# EAGLE design Adafruit 1.54in 240x240 TFT EYESPI (EAGLE 9.6.2)
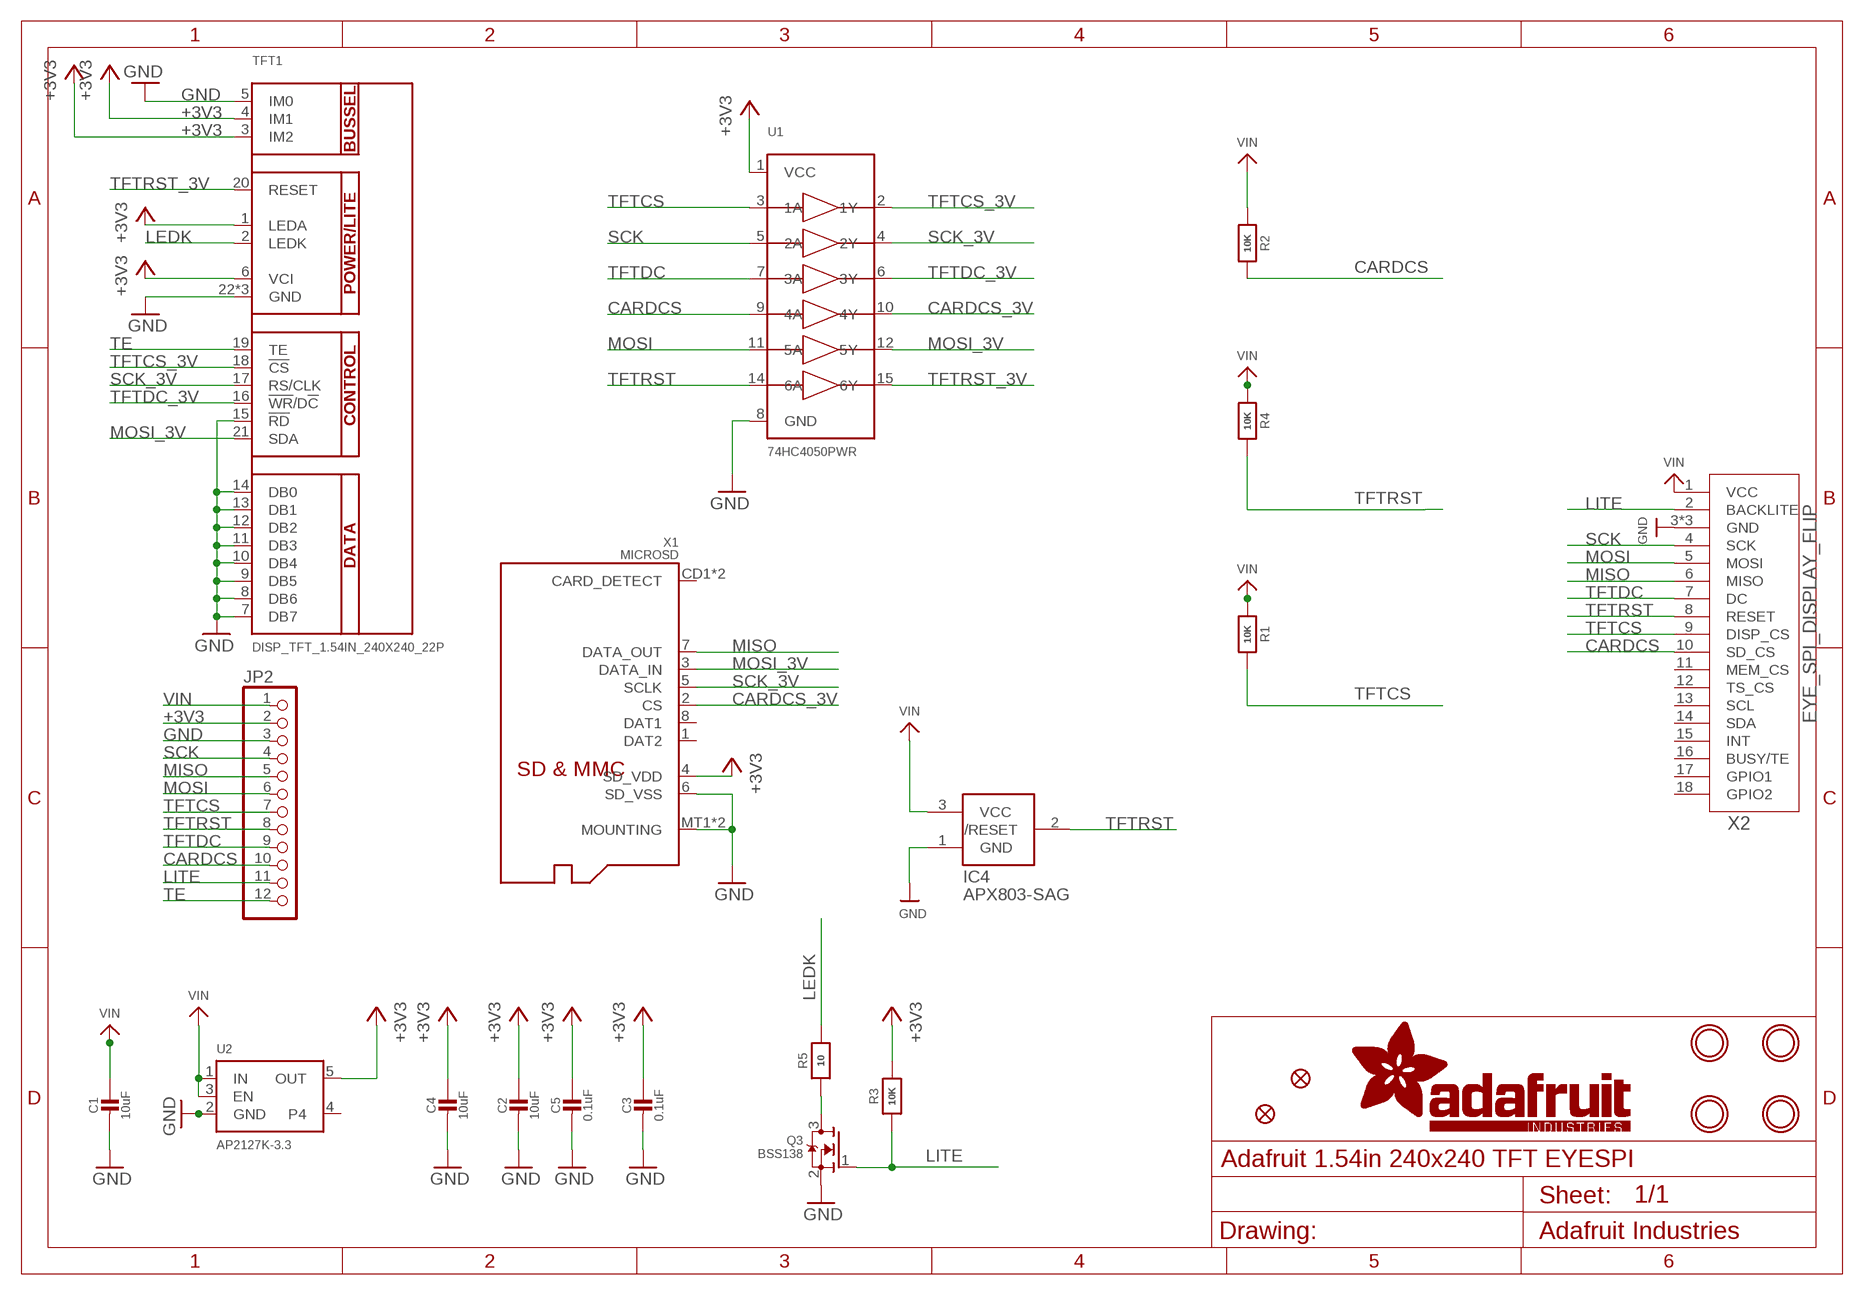
[diagram p0: schematic, sheet 1]

## Parts
C1  10uF  CAP_CERAMIC0805-NOOUTLINE  [0805-NO]
C2  10uF  CAP_CERAMIC0805-NOOUTLINE  [0805-NO]
C3  0.1uF  CAP_CERAMIC0603_NO  [0603-NO]
C4  10uF  CAP_CERAMIC0805-NOOUTLINE  [0805-NO]
C5  0.1uF  CAP_CERAMIC0603_NO  [0603-NO]
IC4  APX803-SAG  APX083-SAG  [SOT23-WIDE]
JP2  HEADER-1X1276MIL  [1X12_ROUND_76MIL]
Q3  BSS138  MOSFET-NWIDE  [SOT23-WIDE]
R1  10K  RESISTOR_0603_NOOUT  [0603-NO]
R2  10K  RESISTOR_0603_NOOUT  [0603-NO]
R3  10K  RESISTOR_0603_NOOUT  [0603-NO]
R4  10K  RESISTOR_0603_NOOUT  [0603-NO]
R5  10  RESISTOR_0603_NOOUT  [0603-NO]
TFT1  DISP_TFT_1.54IN_240X240_22P  [TFT_1.54IN_240X240_22PIN]
U1  74HC4050PWR  74HC4050DTSSOP  [TSSOP16]
U2  AP2127K-3.3  VREG_SOT23-5  [SOT23-5]
U$4  FIDUCIAL_1MM  [FIDUCIAL_1MM]
U$5  FIDUCIAL_1MM  [FIDUCIAL_1MM]
U$7  MOUNTINGHOLE2.5  [MOUNTINGHOLE_2.5_PLATED]
U$8  MOUNTINGHOLE2.5  [MOUNTINGHOLE_2.5_PLATED]
U$9  MOUNTINGHOLE2.5  [MOUNTINGHOLE_2.5_PLATED]
U$10  MOUNTINGHOLE2.5  [MOUNTINGHOLE_2.5_PLATED]
X1  MICROSD  [MICROSD]
X2  EYE_SPI_DISPLAY_FLIP  [EYE_SPI_DISPLAY_BOTCONTACT]

## Nets
+3V3 [power]: C2.1 C3.1 C4.1 C5.1 JP2.2 R3.2 TFT1.1(LEDA) TFT1.3(IM2) TFT1.4(IM1) TFT1.6(VCI) U1.1(VCC) U2.5(OUT) X1.4(SD_VDD)
CARDCS: JP2.10 R2.1 U1.9(4A) X2.10(SD_CS)
CARDCS_3V: U1.10(4Y) X1.2(CS)
GND: C1.2 C2.2 C3.2 C4.2 C5.2 IC4.1(GND) JP2.3 Q3.2(S) TFT1.5(IM0) TFT1.7(DB7) TFT1.8(DB6) TFT1.9(DB5) TFT1.10(DB4) TFT1.11(DB3) TFT1.12(DB2) TFT1.13(DB1) TFT1.14(DB0) TFT1.15(!RD) TFT1.22(GND) TFT1.SUPPORT1(GND) TFT1.SUPPORT2(GND) U1.8(GND) U2.2(GND) X1.6(SD_VSS) X1.MT1(MOUNTING) X1.MT2(MOUNTING) X2.3(GND) X2.SUPPORT1(GND) X2.SUPPORT2(GND)
LEDK: R5.2 TFT1.2(LEDK)
LITE: JP2.11 Q3.1(G) R3.1 X2.2(BACKLITE)
MISO: JP2.5 X1.7(DATA_OUT) X2.6(MISO)
MOSI: JP2.6 U1.11(5A) X2.5(MOSI)
MOSI_3V: TFT1.21(SDA) U1.12(5Y) X1.3(DATA_IN)
N$1: Q3.3(D) R5.1
SCK: JP2.4 U1.5(2A) X2.4(SCK)
SCK_3V: TFT1.17(RS/CLK) U1.4(2Y) X1.5(SCLK)
TE: JP2.12 TFT1.19(TE)
TFTCS: JP2.7 R1.1 U1.3(1A) X2.9(DISP_CS)
TFTCS_3V: TFT1.18(!CS) U1.2(1Y)
TFTDC: JP2.9 U1.7(3A) X2.7(DC)
TFTDC_3V: TFT1.16(!WR!/D!C) U1.6(3Y)
TFTRST: IC4.2(/RESET) JP2.8 R4.1 U1.14(6A) X2.8(RESET)
TFTRST_3V: TFT1.20(RESET) U1.15(6Y)
VIN [power]: C1.1 IC4.3(VCC) JP2.1 R1.2 R2.2 R4.2 U2.1(IN) U2.3(EN) X2.1(VCC)
Unconnected: U2.4 X1.1(DAT2) X1.8(DAT1) X1.CD1(CARD_DETECT) X1.CD2(CARD_DETECT) X2.11(MEM_CS) X2.12(TS_CS) X2.13(SCL) X2.14(SDA) X2.15(INT) X2.16(BUSY/TE) X2.17(GPIO1) X2.18(GPIO2)

## Library data of the parts
C1-C5 = microbuilder:CAP_CERAMIC: Ceramic Capacitors For new designs, use the packages preceded by an '_' character since they are more reliable: The following footprints should be used on most boards: _0402 - Standard footprint for regular board layouts _0603 - Standard footprint for regular board layouts _0805 - Standard footprint for regular board layouts _1206 - Standard footprint for regular board layouts For extremely tight-pitch boards where space is at a premium, the following 'micro-pitch' footprints can be used (smaller pads, no silkscreen outline, etc.): _0402MP - Micro-pitch footprint for very dense/compact boards _0603MP - Micro-pitch footprint for very dense/compact boards _0805MP - Micro-pitch footprint for very dense/compact boards _1206MP - Micro-pitch footprint for very dense/compact boards
IC4 = microbuilder:APX083
JP2 = microbuilder:HEADER-1X12
Q3 = microbuilder:MOSFET-N: N-Channel Mosfet LEGEND VDS: Voltage Drain-Source ID: Drain Current RDS(ON): Drain-Source On-State Resistance VGS(TH): Gate-Source Threshold Voltage CISS: Drain-Source Input Capacitance SOT-23 Name VDS ID RDS(ON) VGS(TH) CISS Order Number 2N7002E 60V 260mA 2.5 Ohm 2.5V @ 250uA 26.7pF @ 25V 2N7002ET1GOSTR-ND BSH103 30V 850mA 400 mOhm 400mV @ 1mA 83pF @ 24V BSH103,235-ND BSS138 60V 320mA 1.6 Ohm 1.5V @ 250uA 50pF @ 10V Mouser: 771-BSS138PW115 DMN2075U-7 20V 4.2A 38 mOhm 1V @ 250 uA 594.3pF @ 10V DMN2075U-7DICT-ND * BSS138 good choice for I2C level-shifting POWERPAK 1212-8 Name VDS ID RDS(ON) VGS(TH) CISS Order Number Si7308DN 60V 6A 58 mOhm 3V @ 250uA 665pF @ 15V SI7308DN-T1-E3CT-ND
R1-R5 = microbuilder:RESISTOR: Resistors For new designs, use the packages preceded by an '_' character since they are more reliable: The following footprints should be used on most boards: _0402 - Standard footprint for regular board layouts _0603 - Standard footprint for regular board layouts _0805 - Standard footprint for regular board layouts _1206 - Standard footprint for regular board layouts For extremely tight-pitch boards where space is at a premium, the following 'micro-pitch' footprints can be used (smaller pads, no silkscreen outline, etc.): _0402MP - Micro-pitch footprint for very dense/compact boards _0603MP - Micro-pitch footprint for very dense/compact boards _0805MP - Micro-pitch footprint for very dense/compact boards _1206MP - Micro-pitch footprint for very dense/compact boards
TFT1 = adafruit_display:DISP_TFT_1.54IN_240X240_22P
U1 = microbuilder:74HC4050D: 6-channel level shifter 74HC4050D - 2V-6V Supply SOIC16 Digikey: 74HC4050D,653-ND Mouser: 771-74HC4050D-T TSSOP16 Digikey: 296-9215-1-ND Mouser:
U2 = adafruit_power:VREG_SOT23-5: SOT23-5 Fixed Voltage Regulators Part Current Out V Out V In V Dropout θJA (°C/W) TJ (°C) Digikey Part No. ADP121 150mA 3.3V 3.4-5.5V 0.09V @ 150mA -- -- ADP121-AUJZ33R7CT-ND ADP121 150mA 3.0V 3.1-5.5V 0.09V @ 150mA -- -- ADP121-AUJZ30R7CT-ND ADP122 300mA 3.3V 3.4-5.5V 0.085V @ 300mA -- -- ADP122AUJZ-3.3-R7CT-ND ADP1712 300mA 3.3V 3.5-5.5V 0.17V @ 300mA -- -- ADP1712AUJZ-3.3-R7TR-ND AP7311 (Low Cost) 150mA 3.3V 3.5-6V 0.15V @ 150mA -- -- AP7311-33WG-7DICT-ND LD39015M18R 150mA 1.8V 1.9V-5.5V 0.08V @ 100mA -- -- 497-6977-1-ND LP2985A-33DBVR 150mA 3.3V 3.3-16V 0.28V @ 150mA 206 150 296-18479-1-ND MCP1824T-3302E/OT 300mA 3.3V 3.5V-6V 0.2V @ 300mA -- -- MCP1824T-3302E/OTCT-ND MIC5205-2.5YM5 TR 150mA 2.5V 2.7-16V 0.165V @ 150mA -- -- 576-1257-2-ND MIC5205-3.0YM5 TR 150mA 3.0V 3.2V-16V 0.165V @ 150mA -- -- 576-1258-2-ND MIC5205-3.3YM5 TR 150mA 3.3V 3.5V-16V 0.165V @ 150mA -- -- 576-1259-2-ND TPS780330220 150mA 3.3V+2.2V 3.6-5.5V 250mV Max -- -- 296-23332-1-ND TDA3663/N1,135 100mA 3.3V 3.5-45V 0.18V @ 50mA -- -- 568-5343-1-ND Max operating temp can be calculated using θJA, TJ (max junction temperature), and power in watts. Set the "Maximum Ambient Temperature" until it reaches TJ ("Max Junction Temperature"), which is the absolute limit for safe use of the regulator: Heat Sink Temperature Calculator <http://www.daycounter.com/Calculators/Heat-Sink-Temperature-Calculator.phtml> For example, With 12V source into a 3.3V LP2985 and a 30mA load, we are dissipating (12V-3.3V) * 0.03A = 0.261W. With a θJA of 206 °C/W, a TJ of 150°C, and 261mW we can safely use the chip without a heat sink up to 75°C (=147.1°C Junction Temperature).; JLC_ROTATION: 270
U$4 U$5 = microbuilder:FIDUCIAL: Fiducial Alignment Points Various fiducial points for machine vision alignment.; BOM: EXCLUDE
U$7-U$10 = adafruit_electromech:MOUNTINGHOLE: Mounting Hole For #2 screws (0.086"/2.18mm width, 0.094"/2.4mm hole) use 2.5mm; BOM: EXCLUDE
X1 = adafruit_electromech:MICROSD: MicroSD/Transflash Card Holder with SPI pinout 3M: 2908-05WB-MG 4UConnector: 19656 Footprint courtesy: Adafruit Industries; JLC_ROTATION: 90; LCSC: C125617
X2 = adafruit_display:EYE_SPI_DISPLAY; LCSC: C2856802

## Net classes
1 power: width 0.254 mm

## Board
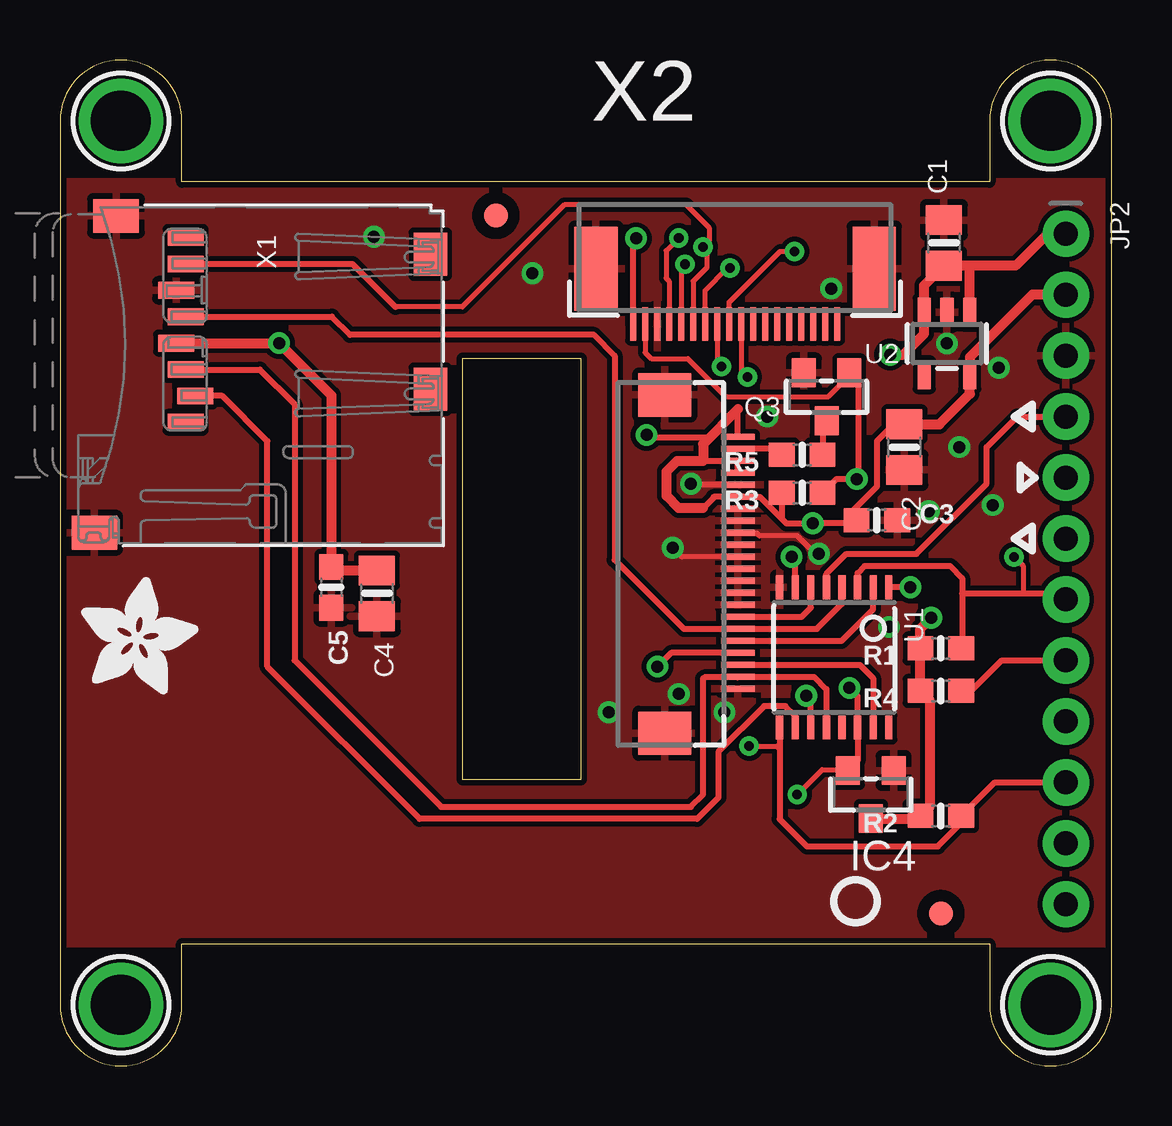
[diagram p1: board, top side]
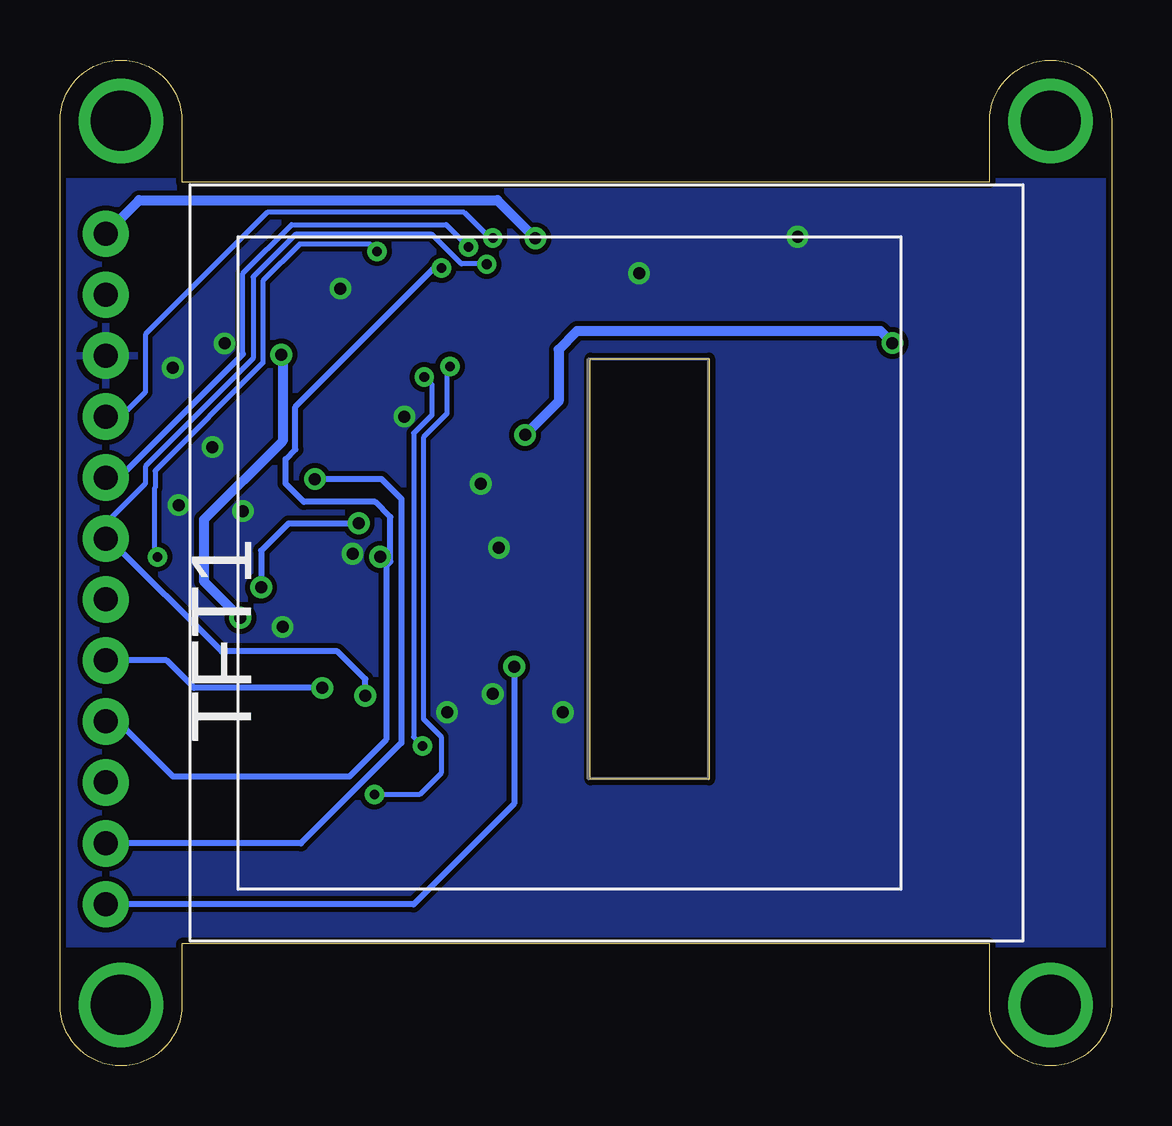
[diagram p2: board, bottom side, seen from below]

Size 43.81 x 41.91 mm. Coordinates in mm from the lower left corner, seen from the top.
Outline: 38.73,5.08 38.73,2.54 arc90 41.27,0 arc90 43.81,2.54 43.81,39.37 arc90 41.27,41.91 arc90 38.73,39.37 38.73,36.83 5.08,36.83 5.08,39.37 arc90 2.54,41.91 arc90 0,39.37 0,2.54 arc90 2.54,0 arc90 5.08,2.54 5.08,5.08 38.73,5.08
Outline: 16.76,29.46 16.76,11.94 21.72,11.94 21.72,29.46 16.76,29.46
Copper layers (1*16): Top 0.035mm / dielectric 1.5mm / Bottom 0.035mm
Design rules "adafruit *": minimum track width 8mil, minimum drill 15.5mil, track to track 8mil, track to pad 8mil, pad to pad 8mil, via to via 8mil, smd to smd 8mil, copper to edge 10mil, drill to drill 8mil, minimum pad ring 10mil, minimum via ring 8mil, stop-mask expansion 2mil, vias tented up to drill 20mil, thermal gap 10mil

### Footprints (pad centres in the part's own frame; a part is rotated, then mirrored left to right if it is on the bottom)
0805-NO = smd 1.24 x 1.5: 1 -0.95,0; 2 0.95,0
0603-NO = smd 1.075 x 1: 1 -0.85,0; 2 0.85,0
SOT23-WIDE = smd 1 x 1.2: 1 -0.95,-1; 2 0.95,-1; 3 0,1
1X12_ROUND_76MIL = drill 1 pad 1.93: 1 -13.97,0; 2 -11.43,0; 3 -8.89,0; 4 -6.35,0; 5 -3.81,0; 6 -1.27,0; 7 1.27,0; 8 3.81,0; 9 6.35,0; 10 8.89,0; 11 11.43,0; 12 13.97,0
TFT_1.54IN_240X240_22PIN = smd 0.25 x 1.4 bottom: 1 5.25,1.198; 2 4.75,1.198; 3 4.25,1.198; 4 3.75,1.198; 5 3.25,1.198; 6 2.75,1.198; 7 2.25,1.198; 8 1.75,1.198; 9 1.25,1.198; 10 0.75,1.198; 11 0.25,1.198; 12 -0.25,1.198; 13 -0.75,1.198; 14 -1.25,1.198; 15 -1.75,1.198; 16 -2.25,1.198; 17 -2.75,1.198; 18 -3.25,1.198; 19 -3.75,1.198; 20 -4.25,1.198; 21 -4.75,1.198; 22 -5.25,1.198 | smd 1.8 x 2.2 bottom: SUPPORT1 7,-1.852; SUPPORT2 -7.1,-1.852
TSSOP16 = smd 0.305 x 0.991: 1 -2.275,-2.918; 2 -1.625,-2.918; 3 -0.975,-2.918; 4 -0.325,-2.918; 5 0.325,-2.918; 6 0.975,-2.918; 7 1.625,-2.918; 8 2.275,-2.918; 9 2.275,2.918; 10 1.625,2.918; 11 0.975,2.918; 12 0.325,2.918; 13 -0.325,2.918; 14 -0.975,2.918; 15 -1.625,2.918; 16 -2.275,2.918
SOT23-5 = smd 0.55 x 1.2: 1 -0.95,-1.3; 2 0,-1.3; 3 0.95,-1.3; 4 0.95,1.3; 5 -0.95,1.3
FIDUCIAL_1MM = smd 1 x 1: 1 0,0
MOUNTINGHOLE_2.5_PLATED = drill 2.5 pad 3.2: P$1 0,0
MICROSD = smd 0.7 x 1.5: 1 1.761,-3.147; 2 0.661,-2.747; 3 -0.439,-3.147; 4 -1.539,-3.547; 5 -2.639,-3.147; 6 -3.739,-3.547; 7 -4.839,-3.147; 8 -5.939,-3.147 | smd 1.8 x 1.4: CD1 -5.239,7.053; CD2 0.38,7.053 | smd 1.4 x 1.9: MT1 -6.839,-6.047; MT2 6.361,-6.947
EYE_SPI_DISPLAY_BOTCONTACT = smd 0.25 x 1.4: 1 4.25,1.154; 2 3.75,1.154; 3 3.25,1.154; 4 2.75,1.154; 5 2.25,1.154; 6 1.75,1.154; 7 1.25,1.154; 8 0.75,1.154; 9 0.25,1.154; 10 -0.25,1.154; 11 -0.75,1.154; 12 -1.25,1.154; 13 -1.75,1.154; 14 -2.25,1.154; 15 -2.75,1.154; 16 -3.25,1.154; 17 -3.75,1.154; 18 -4.25,1.154 | smd 1.8 x 3.5: SUPPORT1 -5.8,-1.152; SUPPORT2 5.8,-1.152

### Placement (x,y rotation side)
C1  36.83,34.29 90 top
C2  35.18,25.78 270 top
C3  34.04,22.73 0 top
C4  13.21,19.69 270 top
C5  11.3,19.94 270 top
IC4  33.78,11.3 180 top
JP2  41.91,20.7 270 top
PLABEL0  [PLABEL0]  38.61,34.29 0 top
PLABEL1  [PLABEL1]  38.35,16.38 0 top
PLABEL2  [PLABEL2]  38.61,13.84 0 top
PLABEL3  [PLABEL3]  40.64,11.94 0 top
PLABEL4  [PLABEL4]  40.77,18.92 0 top
PLABEL5  [PLABEL5]  35.69,21.59 0 top
PLABEL6  [PLABEL6]  36.7,26.54 0 top
PLABEL7  [PLABEL7]  36.07,24 0 top
PLABEL8  [PLABEL8]  38.35,8.89 0 top
PLABEL9  [PLABEL9]  0.76,8.51 0 top
PLABEL10  [PLABEL10]  0.76,5.84 0 top
PLABEL11  [PLABEL11]  0.76,11.3 0 top
PLABEL12  [PLABEL12]  0.76,13.46 0 top
PLABEL13  [PLABEL13]  6.35,15.62 0 top
PLABEL14  [PLABEL14]  40.64,27.94 90 top
PLABEL15  [PLABEL15]  38.1,32.13 0 top
PLABEL16  [PLABEL16]  39.24,6.1 0 top
PLABEL17  [PLABEL17]  40.89,34.67 0 bottom
PLABEL18  [PLABEL18]  40.89,32.13 0 bottom
PLABEL19  [PLABEL19]  40.89,29.59 0 bottom
PLABEL20  [PLABEL20]  40.89,27.05 0 bottom
PLABEL21  [PLABEL21]  40.89,24.51 0 bottom
PLABEL22  [PLABEL22]  40.89,21.97 0 bottom
PLABEL23  [PLABEL23]  40.89,19.43 0 bottom
PLABEL24  [PLABEL24]  40.89,16.89 0 bottom
PLABEL25  [PLABEL25]  40.89,14.35 0 bottom
PLABEL26  [PLABEL26]  40.89,11.81 0 bottom
PLABEL27  [PLABEL27]  40.89,9.27 0 bottom
PLABEL28  [PLABEL28]  1.65,20.7 270 bottom
PLABEL29  [PLABEL29]  40.89,6.73 0 bottom
Q3  31.94,27.88 180 top
R1  36.7,17.4 180 top
R2  36.7,10.41 180 top
R3  30.92,23.88 180 top
R4  36.7,15.62 180 top
R5  30.92,25.46 180 top
TFT1  27.05,20.95 90 bottom
U1  32.26,17.02 180 top
U2  36.96,30.1 180 top
U$1  [ADAFRUIT_5MM]  0.89,15.49 0 top
U$2  [PCBFEAT-REV-040]  33.15,6.86 180 top
U$4  18.16,35.43 0 top
U$5  36.7,6.35 0 top
U$7  2.54,39.37 0 top
U$8  2.54,2.54 0 top
U$9  41.27,39.37 0 top
U$10  41.27,2.54 0 top
X1  8.38,28.58 270 top
X2  28.13,32.07 180 top

### Tracks (layer width: path | path; a pad name or v marks a point on that pad's centre or on a via)
+3V3  (via drill 0.5)
  Top 0.254: v24.44,26.29 24.57,26.16 27.02,26.16 28.25,27.39 TFT1.1 28.25,27.36 | 30.07,22.8 30.27,22.61 v31.37,22.61 33.06,22.61 C3.1 32.91,23.01 34.04,24.13 34.04,26.03 34.73,26.73 C2.1 | 30.07,22.8 29.17,23.7 TFT1.6 27.23,23.7 27.23,23.68 26.8,23.24 | v35.43,19.94 U1.1 | 11.46,20.63 C5.1 | 26.8,25.2 TFT1.3 TFT1.4 | R3.2 30.07,22.8
  Top 0.406: C4.1 11.46,20.63 | X1.4 v9.13,30.11 11.3,27.94 C5.1 | 26.8,23.24 25.78,23.24 25.27,23.75 25.27,24.77 25.71,25.2 26.8,25.2 26.8,25.91 28.25,27.36 | JP2.2 40.51,32.13 37.91,29.52 U2.5 37.91,28 36.64,26.73 C2.1
  Bottom 0.254: v35.43,19.94 35.43,21.46 34.29,22.61 v31.37,22.61
  Bottom 0.406: v9.13,30.11 9.64,30.62 22.27,30.62 23.04,29.84 23.04,27.69 v24.44,26.29
CARDCS  (via drill 0.4)
  Top 0.203: v28.64,28.7 28.38,28.7 X2.10 | v28.71,13.32 29.87,13.32 29.98,13.21
  Top 0.254: U1.9 29.98,13.21 29.98,10.28 31.12,9.14 36.58,9.14 37.55,10.12 R2.1 38.95,11.81 JP2.10
  Bottom 0.203: v28.64,28.7 28.33,28.39 28.33,27.12 29.08,26.36 29.08,13.7 v28.71,13.32
CARDCS_3V
  Top 0.254: U1.10 30.63,14.58 30.23,14.99 29.34,14.99 27.43,13.08 27.43,11.18 26.54,10.29 14.99,10.29 8.64,16.64 8.64,26.03 6.76,27.91 X1.2
GND  (via drill 0.5)
  Top 0.203: TFT1.9 29.01,22.2 29.14,22.08 30.72,22.08 31.46,21.34 v31.62,21.34 | TFT1.11 25.91,21.2 v25.53,21.59
  Top 0.254: TFT1.5 26.34,24.2 v26.29,24.26
  other vias: 25.78,15.49 27.69,14.73 38.86,23.37 36.2,23.11 36.96,30.1 37.46,25.78 29.46,27.05 34.54,18.29 22.86,14.73 32.13,32.38 39.12,29.08 13.08,34.54 19.69,33.02
  pour Top: 0,5.08 0,36.83 43.56,36.83 43.56,5.08
  pour Bottom: 0,5.08 0,36.83 43.56,36.83 43.56,5.08
LEDK
  Top 0.254: R5.2 29.83,25.7 TFT1.2
LITE  (via drill 0.5)
  Top 0.203: X2.2 24.38,29.72 24.64,29.46 26.16,29.46 27.75,27.88 32,27.88 32.89,28.76 Q3.1 | 32.66,29.11 32.73,29.17
  Top 0.254: R3.1 32.35,24.45 v33.19,24.45 33.26,24.51 33.26,28.64 32.73,29.17 | 32.66,29.11 Q3.1
  Bottom 0.254: v33.19,24.45 30.42,24.45 29.59,23.62 29.59,13.46 33.78,9.27 JP2.11
MISO  (via drill 0.4)
  Top 0.203: X2.6 26.38,32.69 26.95,33.26 26.95,33.97 v26.8,34.12 27.05,34.38 27.05,34.92 26.1,35.88 21.02,35.88 16.76,31.62 13.97,31.62
  Top 0.254: X1.7 12.18,33.41 13.97,31.62
  Bottom 0.203: 36.2,29.66 36.2,33.02 34.16,35.05 27.73,35.05 v26.8,34.12
  Bottom 0.254: JP2.5 41.34,24.51 36.2,29.66
MOSI  (via drill 0.4, 0.5)
  Top 0.203: X2.5 25.88,33.25 v26.03,33.4
  Top 0.254: U1.11 31.28,15.2 31.09,15.39 v31.09,15.42
  Bottom 0.203: v26.03,33.4 26.05,33.41 27.09,33.41 28.32,34.65 33.99,34.65 35.76,32.88 35.76,29.48 40.26,24.98 40.26,24.26 41.91,22.61 JP2.6
  Bottom 0.254: v31.09,15.42 31.09,16.11 32.26,17.27 37.08,17.27 41.78,21.97 JP2.6
MOSI_3V
  Top 0.254: U1.12 31.93,15.69 31.42,16.2 TFT1.21 28.23,16.18 26.85,16.18 26.8,16.13 26.8,11.3 26.29,10.79 15.88,10.79 9.78,16.89 9.78,27.56 8.32,29.01 X1.3
N$1
  Top 0.254: Q3.3 31.77,26.88 R5.1
SCK  (via drill 0.4)
  Top 0.203: v25.78,34.5 25.25,33.97 25.25,32.82 25.38,32.69 X2.4
  Top 0.254: U1.5 31.93,20.5 32.77,21.34 35.69,21.34 38.61,24.26 38.61,25.78 39.88,27.05 JP2.4
  Bottom 0.203: v25.78,34.5 25.91,34.5 26.97,35.56 35.18,35.56 40.26,30.48 40.26,28.07 41.27,27.05 JP2.4
SCK_3V
  Top 0.254: U1.4 32.58,19.25 31.54,18.2 TFT1.17 25.99,18.2 23.11,21.08 23.11,29.59 22.25,30.45 12.09,30.45 11.33,31.21 X1.5
TE  (via drill 0.5)
  Top 0.254: TFT1.19 25.46,17.2 v24.89,16.64
  Bottom 0.254: v24.89,16.64 24.89,10.92 29.08,6.73 JP2.12
TFTCS  (via drill 0.4)
  Top 0.203: X2.9 27.88,31.82 30,33.94 v30.61,33.94 | v39.75,21.21 40.13,20.83 40.13,19.69
  Top 0.254: R1.1 37.59,17.4 37.59,19.69 | U1.3 33.23,20.53 33.53,20.83 37.08,20.83 37.59,20.32 37.59,19.69 | 37.59,19.69 40.13,19.69 41.66,19.69 JP2.7
  Bottom 0.203: v30.61,33.94 30.91,34.24 33.83,34.24 35.36,32.71 35.36,29.29 39.85,24.79 39.85,24.09 39.88,24.06 39.88,21.34 v39.75,21.21
TFTCS_3V
  Top 0.254: TFT1.18 32.56,17.7 33.88,19.02 U1.2
TFTDC  (via drill 0.4, 0.5)
  Top 0.203: v27.91,33.24 27.81,33.24 26.88,32.3 X2.7
  Top 0.254: U1.7 30.63,21.06 v30.48,21.21
  Bottom 0.254: v30.48,21.21 30.48,21.08 30.23,20.83 | 30.23,20.83 30.23,13.59 31.75,12.07 39.12,12.07 41.4,14.35 JP2.9 | 30.23,20.83 30.05,21.01 30.05,22.86 30.68,23.49 33.66,23.49 34.42,24.26 34.42,25.28 34.01,25.69 34.01,27.46 28.23,33.24 v27.91,33.24
TFTDC_3V
  Top 0.254: TFT1.16 30.9,18.7 31.28,19.09 U1.6
TFTRST  (via drill 0.4, 0.5)
  Top 0.203: X2.8 27.38,29.33 v27.56,29.15 | v30.72,11.3 31.76,12.34 32.87,12.34
  Top 0.254: v32.89,15.75 33.23,15.41 U1.14 33.23,12.7 32.87,12.34 IC4.2 | R4.1 37.97,15.62 39.24,16.89 JP2.8
  Bottom 0.203: v27.56,29.15 27.69,29.15 27.69,27.17 28.68,26.19 28.68,14.45 27.94,13.72 27.94,12.19 28.83,11.3 v30.72,11.3
  Bottom 0.254: v32.89,15.75 38.23,15.75 39.37,16.89 JP2.8
TFTRST_3V
  Top 0.254: TFT1.20 33.33,16.7 33.88,16.16 U1.15
VIN  (via drill 0.5)
  Top 0.254: R2.2 36.23,10.79 | X2.1 23.88,34.36
  Top 0.406: 36.23,10.79 36.23,15.24 R4.2 R1.2 35.85,18.22 v36.3,18.67 | IC4.3 35.85,10.3 R2.2 | JP2.1 41.15,34.67 39.82,33.34 37.97,33.34 | 37.97,33.34 C1.1 36.01,32.52 U2.3 36.01,30.51 35.13,29.63 v34.59,29.63 | U2.1 37.91,33.27 37.97,33.34 | v24,34.48 23.88,34.36
  Bottom 0.406: v36.3,18.67 37.82,20.19 37.82,22.75 34.54,26.03 34.54,29.58 v34.59,29.63 | v24,34.48 25.59,36.07 40.51,36.07 JP2.1

### Text on the board
Pinguin_tBackup: Vin | 3Vo | Gnd | SCK | MISO | MOSI | TFTCS | RST | from / adafruit! | DC | Logic: 3.3-5V | SDCS | Power: 3.3-5V | Lite | 240x240 TFT display | TE | w/uSD card (ST7789)
Pinguin_bBackup: V+ | 3V | G | CK | SO | SI | 1.54" ST7789 240x240 | TC | RT | DC | CC | BL | TE